# Altium schematic sheet Month.SchDoc
size A4; SheetNumber: 3; SheetTotal: 3
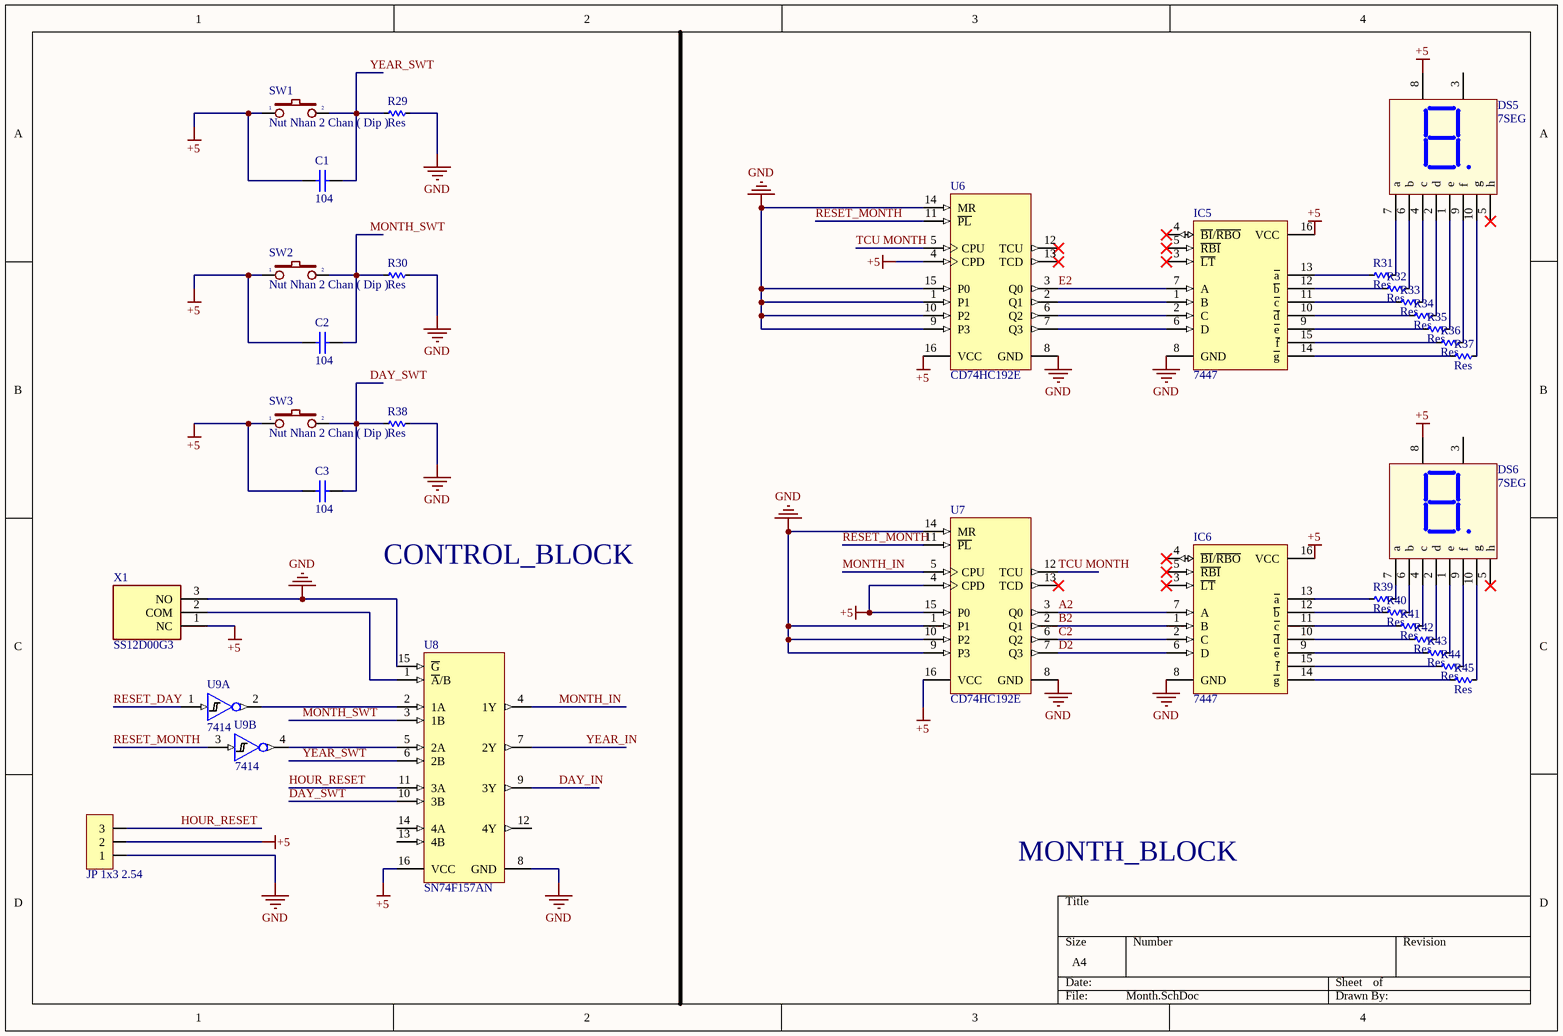
[diagram p0: Month.SchDoc]

## Parts
C1  104  [tu gom]
C2  104  [tu gom]
C3  104  [tu gom]
DS5  7SEG  [LED7SEG-1-0.56]
DS6  7SEG  [LED7SEG-1-0.56]
IC5  7447  [DIP16]
IC6  7447  [DIP16]
JP1  JP 1x3 2.54  [JP 1x3 CT]
R29  Res  [RES-1/4W]
R30  Res  [RES-1/4W]
R31  Res  [RES-1/4W]
R32  Res  [RES-1/4W]
R33  Res  [RES-1/4W]
R34  Res  [RES-1/4W]
R35  Res  [RES-1/4W]
R36  Res  [RES-1/4W]
R37  Res  [RES-1/4W]
R38  Res  [RES-1/4W]
R39  Res  [RES-1/4W]
R40  Res  [RES-1/4W]
R41  Res  [RES-1/4W]
R42  Res  [RES-1/4W]
R43  Res  [RES-1/4W]
R44  Res  [RES-1/4W]
R45  Res  [RES-1/4W]
SW1  Nut Nhan 2 Chan ( Dip )  [SW2]
SW2  Nut Nhan 2 Chan ( Dip )  [SW2]
SW3  Nut Nhan 2 Chan ( Dip )  [SW2]
U6  CD74HC192E  [N0016A]
U7  CD74HC192E  [N0016A]
U8  SN74F157AN  [N0016A]
U9  7414  [DIP14]  (parts A,B of 7)
X1  SS12D00G3  [SS12D00G3]

## Nets
+5: C1.2 C2.2 C3.2 DS5.8(Vcc) DS6.8(Vcc) IC5.16(VCC) IC6.16(VCC) JP1.2 SW1.1 SW2.1 SW3.1 U6.4(CPD) U6.16(VCC) U7.4(CPD) U7.15(P0) U7.16(VCC) U8.16(VCC) X1.1(NC)
GND: IC5.8(GND) IC6.8(GND) JP1.1 R29.1 R30.1 R38.1 U6.1(P1) U6.8(GND) U6.9(P3) U6.10(P2) U6.14(MR) U6.15(P0) U7.1(P1) U7.8(GND) U7.9(P3) U7.10(P2) U7.14(MR) U8.8(GND) U8.15(~{G}) X1.3(NO)
A2: IC6.7(A) U7.3(Q0)
B2: IC6.1(B) U7.2(Q1)
C2: IC6.2(C) U7.6(Q2)
D2: IC6.6(D) U7.7(Q3)
DAY_IN: U8.9(3Y)
DAY_SWT: C3.1 R38.2 SW3.2 U8.10(3B)
E2: IC5.7(A) U6.3(Q0)
HOUR_RESET: JP1.3 U8.11(3A)
MONTH_IN: U7.5(CPU) U8.4(1Y)
MONTH_SWT: C2.1 R30.2 SW2.2 U8.3(1B)
RESET_DAY: U9.1(A)
RESET_MONTH: U6.11(~{PL}) U7.11(~{PL}) U9.3(A)
TCU MONTH: U6.5(CPU) U7.12(TCU)
YEAR_IN: U8.7(2Y)
YEAR_SWT: C1.1 R29.2 SW1.2 U8.6(2B)
NetDS5_1: DS5.1(e) R35.1
NetDS5_2: DS5.2(d) R34.1
NetDS5_4: DS5.4(c) R33.1
NetDS5_6: DS5.6(b) R32.1
NetDS5_7: DS5.7(a) R31.1
NetDS5_9: DS5.9(f) R36.1
NetDS5_10: DS5.10(g) R37.1
NetDS6_1: DS6.1(e) R43.1
NetDS6_2: DS6.2(d) R42.1
NetDS6_4: DS6.4(c) R41.1
NetDS6_6: DS6.6(b) R40.1
NetDS6_7: DS6.7(a) R39.1
NetDS6_9: DS6.9(f) R44.1
NetDS6_10: DS6.10(g) R45.1
NetIC5_1: IC5.1(B) U6.2(Q1)
NetIC5_2: IC5.2(C) U6.6(Q2)
NetIC5_6: IC5.6(D) U6.7(Q3)
NetIC5_9: IC5.9(~{e}) R35.2
NetIC5_10: IC5.10(~{d}) R34.2
NetIC5_11: IC5.11(~{c}) R33.2
NetIC5_12: IC5.12(~{b}) R32.2
NetIC5_13: IC5.13(~{a}) R31.2
NetIC5_14: IC5.14(~{g}) R37.2
NetIC5_15: IC5.15(~{f}) R36.2
NetIC6_9: IC6.9(~{e}) R43.2
NetIC6_10: IC6.10(~{d}) R42.2
NetIC6_11: IC6.11(~{c}) R41.2
NetIC6_12: IC6.12(~{b}) R40.2
NetIC6_13: IC6.13(~{a}) R39.2
NetIC6_14: IC6.14(~{g}) R45.2
NetIC6_15: IC6.15(~{f}) R44.2
NetU8_1: U8.1(~{A}/B) X1.2(COM)
NetU8_2: U8.2(1A) U9.2(Y)
NetU8_5: U8.5(2A) U9.4(Y)

Not connected (* = marked no-connect by the designer): DS5 3(Vcc) 5(h)*; DS6 3(Vcc) 5(h)*; IC5 3(~{LT})* 4(~{BI}/~{RBO})* 5(~{RBI})*; IC6 3(~{LT})* 4(~{BI}/~{RBO})* 5(~{RBI})*; U6 12(TCU)* 13(TCD)*; U7 13(TCD)*; U8 12(4Y) 13(4B) 14(4A)

## Notes on the sheet
- CONTROL_BLOCK
- MONTH_BLOCK

## Library data of the parts
C1-C3 = Tu gom 104 50V: Cắm; So_Chan: 2; Ten_Linh_Kien: Tụ gốm 104 100nF 50V; Don_Vi: Con; Ma_Hang: MH004761; Chung_Loai: Cắm; Kieu_Chan: *
DS5 DS6 = LED7SEG-1: 14.2 mm General Purpose Blue 7-Segment Display: CC, RH DP, Gray Surface; MinimumIntensity: 2020 ucd; Note: IF = 10 mA; Published: 8-Jun-2000; LatestRevisionDate: 17-Dec-2003; LatestRevisionNote: Schematic revised, PCB Footprint replaced.; DatasheetDocument: 24-Sep-2002; PackageDocument: 24-Sep-2002; PackageReference: H; Publisher: Altium Limited; Colour: Blue; ComponentLink1Description: Manufacturer Link; ComponentLink1URL: http://www.agilent.com/
IC5 IC6 = 7447: BCD to 7-Segment Decoder/Driver; Value: 7447 , 74247
JP1 = JP 1x3 2.54 Cai Thang: Cắm; Ten_Linh_Kien: Jump Đơn Cái 2.54MM 1x20P Thẳng; Don_Vi: Con; Ma_Hang: MH004006; Ghi_Chu: *; Kieu_Chan: *; Chung_Loai: Cắm
R29-R45 = Res: Manufacturer: Generic Components; Class: Passive; SubClass: R; Published: 08/06/2000; Publisher: Altium Hobart Technology Centre
SW1-SW3 = Nut Nhan 2 Chan ( Dip ): Cắm; Ten_Linh_Kien: Nút Nhấn 2 Chân 6x6x5MM DIP; Ma_Hang: MH001959; Don_Vi: Con; Kieu_Chan: *; Ghi_Chu: *; Chung_Loai: Cắm
U6 U7 = 74192: High Speed CMOS Logic Presettable Synchronous BCD Decade Up/Down Counter with Asynchronous Reset, N0016A, TUBE; Manufacturer: Texas Instruments; Output Drive (IOL/IOH)(Max)(mA): 5.2/-5.2; Inputs: 1; VCC(Min)(V): 2; ICC @ Nom Voltage(Max)(mA): 0.08; Input Type: LVTTL/CMOS; Technology Family: HC; F @ Nom Voltage(Max)(Mhz): 28; VCC(Max)(V): 6; Bits(#): 4; Rating: Catalog; tpd @ Nom Voltage(Max)(ns): 46; Voltage(Nom)(V): 3.3,5; Schmitt Trigger: No; PackageReference: N0016A; Code_JEDEC: MS-001; Generic Part Number: CD74HC192; Type: Decade; DatasheetVersion: SCHS163F; Operating Temperature Range(C): -55 to 125; Function: Counter; Output Type: CMOS
U8 = CMP-1633-00611-2: Quadruple 2-Line To 1-Line Data Selectors/Multiplexers, N0016A, TUBE; Manufacturer: Texas Instruments; Channels(#): 4; F @ Nom Voltage(Max)(Mhz): 70; Schmitt Trigger: No; Configuration: 2：1; Voltage(Nom)(V): 5; VCC(Min)(V): 4.5; tpd @ Nom Voltage(Max)(ns): 11; Rating: Catalog; VCC(Max)(V): 5.5; Technology Family: F; ICC @ Nom Voltage(Max)(mA): 23; Function: Encoder/Multiplexer; Output Drive (IOL/IOH)(Max)(mA): 20/-1; DatasheetVersion: SDFS053A; Operating Temperature Range(C): 0 to 70; Code_JEDEC: MS-001; Generic Part Number: SN74F157A; Type: Standard; PackageReference: N0016A
U9 = 7414: IC, M74HC04M, Hex Inverter, SO-14; Text Field1: ST; Text Field2: M74HC04M1R; Text Field3: Mouser; Text Field4: 511-M74HC04M; Text Field6: .22; Text Field5: SO-14; NI?: *; O?: *; Section:: *
X1 = SS12D00G3: 3 Pin Toggle Switch; Manufacturer_Name: Vimex; Geometry.Height: 7mm; Manufacturer_Part_Number: SS12D00G3; Mouser Part Number: *; Mouser Price/Stock: *; Arrow Part Number: *; Arrow Price/Stock: *; Datasheet Link: http://vimex.com/switches/techdocs/SS12D00-tech.pdf